# EAGLE design goodfet23 (EAGLE 5.06)
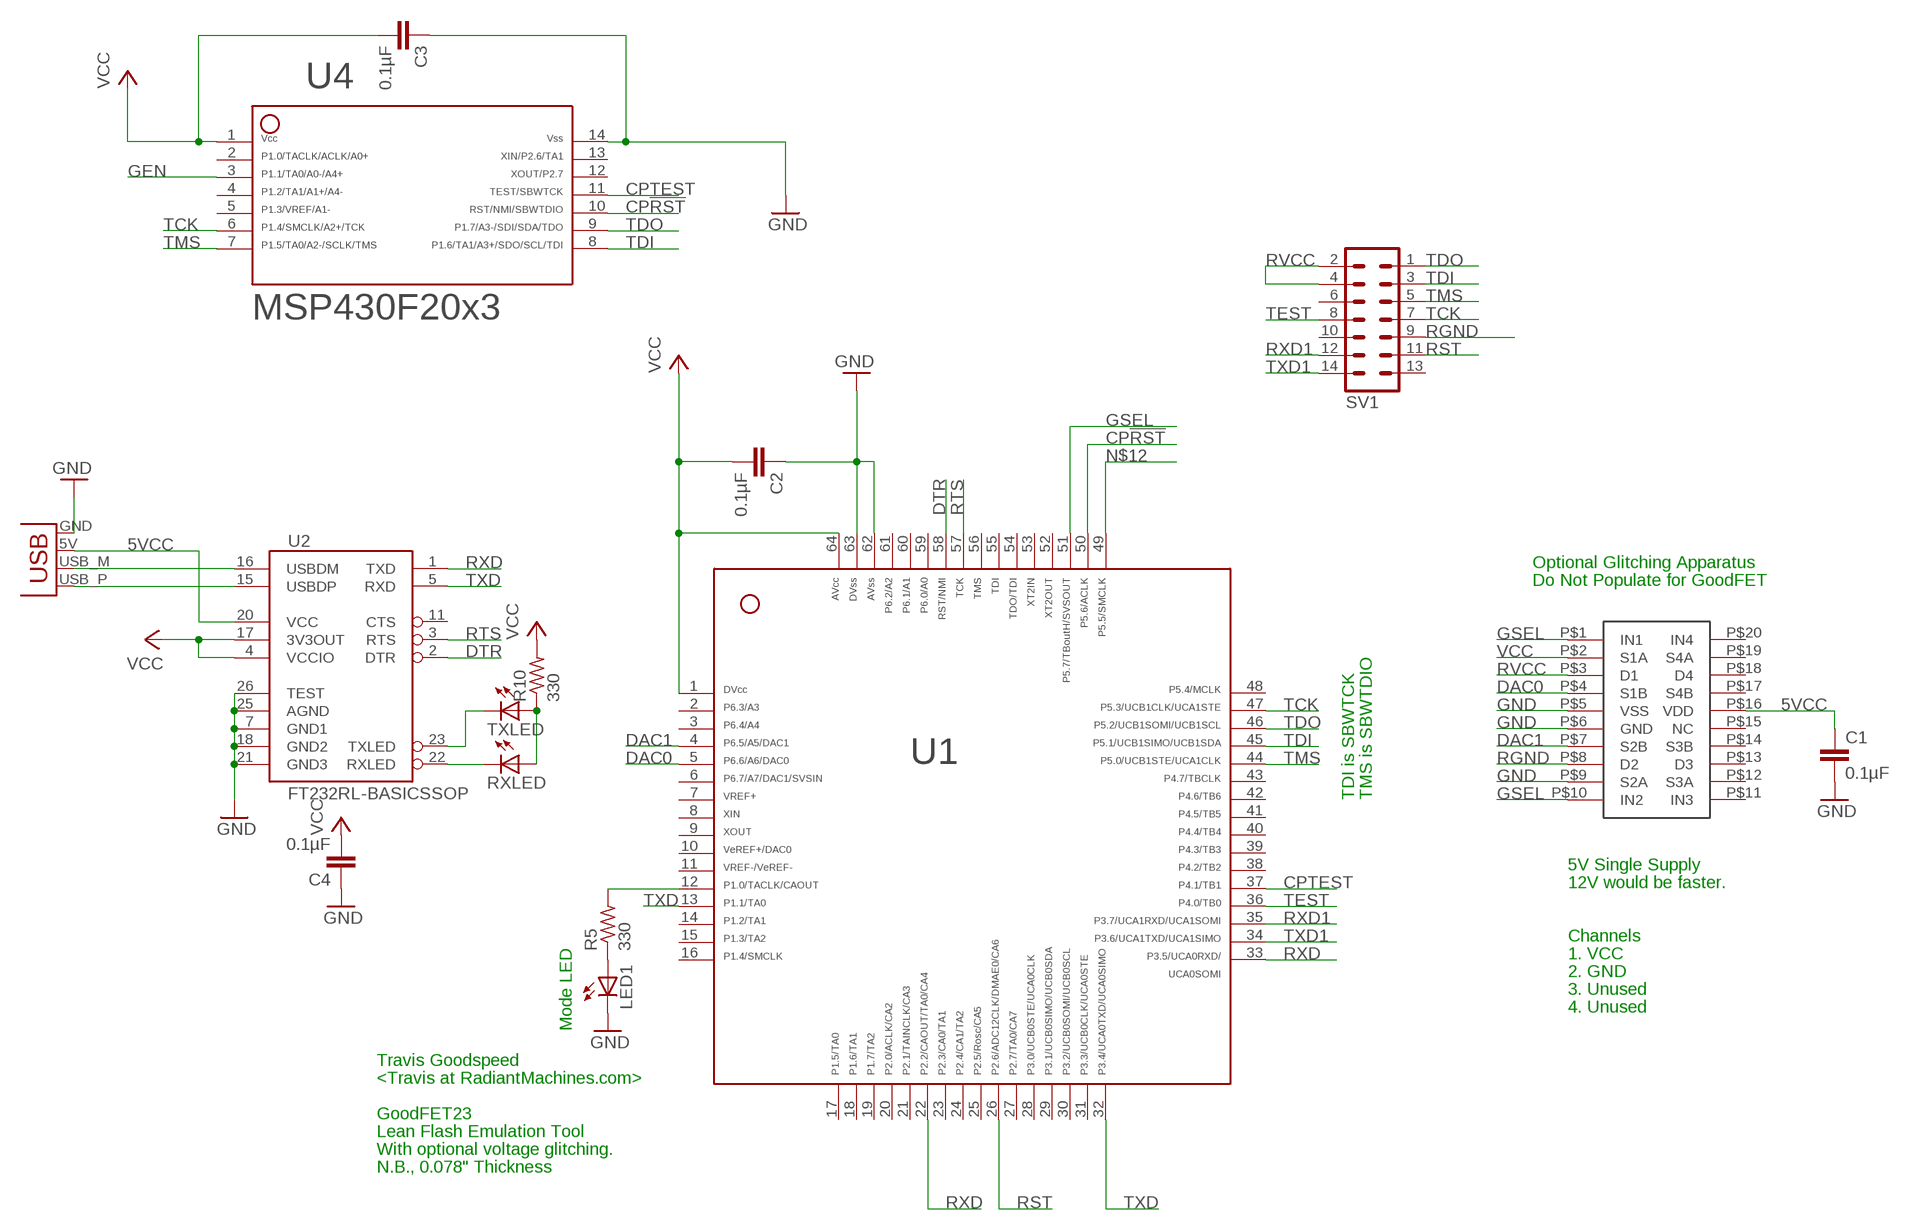
[diagram p0: schematic, sheet 1]

## Parts
C1  0.1µF  C-EUC0603  [C0603]
C2  0.1µF  C-EUC0603  [C0603]
C3  0.1µF  C-EUC0603  [C0603]
C4  0.1µF  C-EUC0603  [C0603]
LED1  LEDCHIP-LED0603  [CHIP-LED0603]
R5  330  R-US_R0603  [R0603]
R10  330  R-US_R0603  [R0603]
RXLED  LEDCHIP-LED0603  [CHIP-LED0603]
SV1  MA07-2  [MA07-2]
TXLED  LEDCHIP-LED0603  [CHIP-LED0603]
U1  F261X---PM64  [PM/PAG64]
U2  FT232RL-BASICSSOP  [SSOP28DB]
U3  ADG1634TSSOP20  [ADG1663TSSOP]
U4  F20X3---PW14  [PW14]
X1  USBPCB  [USB-A-PCB]

## Nets
5VCC: C1.1 U2.20(VCC) U3.P$16(VDD) X1.5V(VBUS)
CP!RST: U1.50 U4.10
CPTEST: U1.37 U4.11
DAC0: U1.5 U3.P$4(S1B)
DAC1: U1.4 U3.P$7(S2B)
DTR: U1.58 U2.2(DTR)
GEN: U4.3
GND: C1.2 C2.1 C3.1 C4.1 LED1.C U1.62 U1.63 U2.7(GND1) U2.18(GND2) U2.21(GND3) U2.25(AGND) U2.26(TEST) U3.P$5(VSS) U3.P$6(GND) U3.P$9(S2A) U4.14 X1.GND
GSEL: U1.51 U3.P$1(IN1) U3.P$10(IN2)
N$1: R5.2 U1.12
N$2: LED1.A R5.1
N$3: U2.15(USBDP) X1.USB_P(D+)
N$4: U2.16(USBDM) X1.USB_M(D-)
N$6: RXLED.C U2.22(RXLED)
N$7: TXLED.C U2.23(TXLED)
N$8: R10.1 RXLED.A TXLED.A
N$12: U1.49
RGND: SV1.9 U3.P$8(D2)
RST: SV1.11 U1.26
RTS: U1.57 U2.3(RTS)
RVCC: SV1.2 SV1.4 U3.P$3(D1)
RXD: U1.22 U1.33 U2.1(TXD)
RXD1: SV1.12 U1.35
TCK: SV1.7 U1.47 U4.6
TDI: SV1.3 U1.45 U4.8
TDO: SV1.1 U1.46 U4.9
TEST: SV1.8 U1.36
TMS: SV1.5 U1.44 U4.7
TXD: U1.13 U1.32 U2.5(RXD)
TXD1: SV1.14 U1.34
VCC: C2.2 C3.2 C4.2 R10.2 U1.1 U1.64 U2.4(VCCIO) U2.17(3V3OUT) U3.P$2(S1A) U4.1
Unconnected: SV1.6 SV1.10 SV1.13 U1.2 U1.3 U1.6 U1.7 U1.8 U1.9 U1.10 U1.11 U1.14 U1.15 U1.16 U1.17 U1.18 U1.19 U1.20 U1.21 U1.23 U1.24 U1.25 U1.27 U1.28 U1.29 U1.30 U1.31 U1.38 U1.39 U1.40 U1.41 U1.42 U1.43 U1.48 U1.52 U1.53 U1.54 U1.55 U1.56 U1.59 U1.60 U1.61 U2.11(CTS) U3.P$11(IN3) U3.P$12(S3A) U3.P$13(D3) U3.P$14(S3B) U3.P$15(NC) U3.P$17(S4B) U3.P$18(D4) U3.P$19(S4A) U3.P$20(IN4) U4.2 U4.4 U4.5 U4.12 U4.13

## Notes on the sheet
- Optional Glitching Apparatus
- Do Not Populate for GoodFET
- TDI is SBWTCK | TMS is SBWTDIO
- 5V Single Supply
- 12V would be faster.
- Channels
- 1. VCC
- 2. GND
- 3. Unused
- 4. Unused
- Mode LED
- Travis Goodspeed
- <Travis at RadiantMachines.com>
- GoodFET23
- Lean Flash Emulation Tool
- With optional voltage glitching.
- N.B., 0.078" Thickness

## Library data of the parts
C1-C4 = rcl:C-EU: CAPACITOR, European symbol
LED1 RXLED TXLED = led:LED: LED OSRAM: - CHIPLED LG R971, LG N971, LY N971, LG Q971, LY Q971, LO R971, LY R971 LH N974, LH R974 LS Q976, LO Q976, LY Q976 LO Q996 - Hyper CHIPLED LW Q18S LB Q993, LB Q99A, LB R99A - SideLED LS A670, LO A670, LY A670, LG A670, LP A670 LB A673, LV A673, LT A673, LW A673 LH A674 LY A675 LS A676, LA A676, LO A676, LY A676, LW A676 LS A679, LY A679, LG A679 - Hyper Micro SIDELED® LS Y876, LA Y876, LO Y876, LY Y876 LT Y87S - SmartLED LW L88C, LW L88S LB L89C, LB L89S, LG L890 LS L89K, LO L89K, LY L89K LS L896, LA L896, LO L896, LY L896 - TOPLED LS T670, LO T670, LY T670, LG T670, LP T670 LSG T670, LSP T670, LSY T670, LOP T670, LYG T670 LG T671, LOG T671, LSG T671 LB T673, LV T673, LT T673, LW T673 LH T674 LS T676, LA T676, LO T676, LY T676, LB T676, LH T676, LSB T676, LW T676 LB T67C, LV T67C, LT T67C, LS T67K, LO T67K, LY T67K, LW E67C LS E67B, LA E67B, LO E67B, LY E67B, LB E67C, LV E67C, LT E67C LW T67C LS T679, LY T679, LG T679 LS T770, LO T770, LY T770, LG T770, LP T770 LB T773, LV T773, LT T773, LW T773 LH T774 LS E675, LA E675, LY E675, LS T675 LS T776, LA T776, LO T776, LY T776, LB T776 LHGB T686 LT T68C, LB T68C - Hyper Mini TOPLED® LB M676 - Mini TOPLED Santana® LG M470 LS M47K, LO M47K, LY M47K Source: http://www.osram.convergy.de LUXEON: - LUMILED® LXK2-PW12-R00, LXK2-PW12-S00, LXK2-PW14-U00, LXK2-PW14-V00 LXK2-PM12-R00, LXK2-PM12-S00, LXK2-PM14-U00 LXK2-PE12-Q00, LXK2-PE12-R00, LXK2-PE12-S00, LXK2-PE14-T00, LXK2-PE14-U00 LXK2-PB12-K00, LXK2-PB12-L00, LXK2-PB12-M00, LXK2-PB14-N00, LXK2-PB14-P00, LXK2-PB14-Q00 LXK2-PR12-L00, LXK2-PR12-M00, LXK2-PR14-Q00, LXK2-PR14-R00 LXK2-PD12-Q00, LXK2-PD12-R00, LXK2-PD12-S00 LXK2-PH12-R00, LXK2-PH12-S00 LXK2-PL12-P00, LXK2-PL12-Q00, LXK2-PL12-R00 Source: www.luxeon.com KINGBRIGHT: KA-3528ASYC Source: www.kingbright.com
R5 R10 = rcl:R-US_: RESISTOR, American symbol
SV1 = con-lstb:MA07-2: PIN HEADER
U1 = TI_MSP430_v13:F261X---PM64: ***MSP430F261x***PM64
U2 = SparkFun:FT232RL-BASIC: USB UART This is the simplified version of the FT232RL unit. Only what you need, nothing you don't. Spark Fun Electronics SKU : COM-00650
U3 = adg1634:ADG1634: The ADG1634 is a monolithic industrial CMOS analog switch comprising four independently selectable SPDT switches. It can be powered at 3V to 12V, single or double supply. At 5V single supply, it has a 200ns swich time.
U4 = TI_MSP430_v13:F20X3---PW14: ***MSP430F20x3***PW14
X1 = SparkFun:USB: USB Connectors USB-B-PTH is fully proven SKU : PRT-00139 USB-miniB is fully proven SKU : PRT-00587 USB-A-PCB is untested. USB-A-H is throughly reviewed, but untested. Spark Fun Electronics SKU : PRT-00437 USB-B-SMT is throughly reviewed, but untested. Needs silkscreen touching up. USB-A-S has not been used/tested USB-MB-H has not been used/tested

## Board
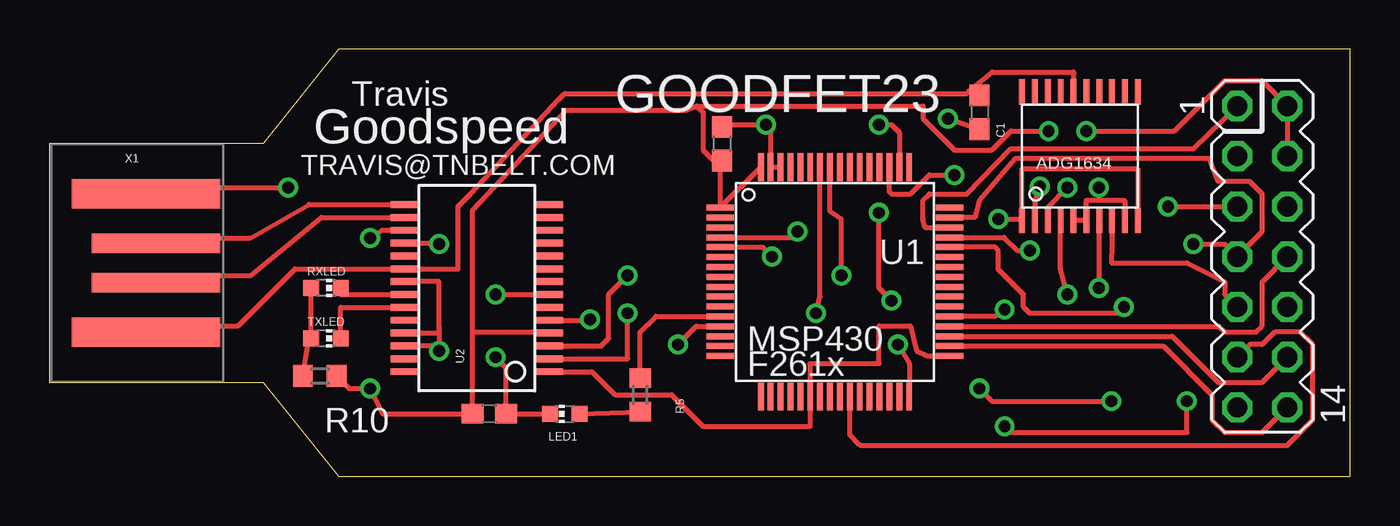
[diagram p1: board, top side]
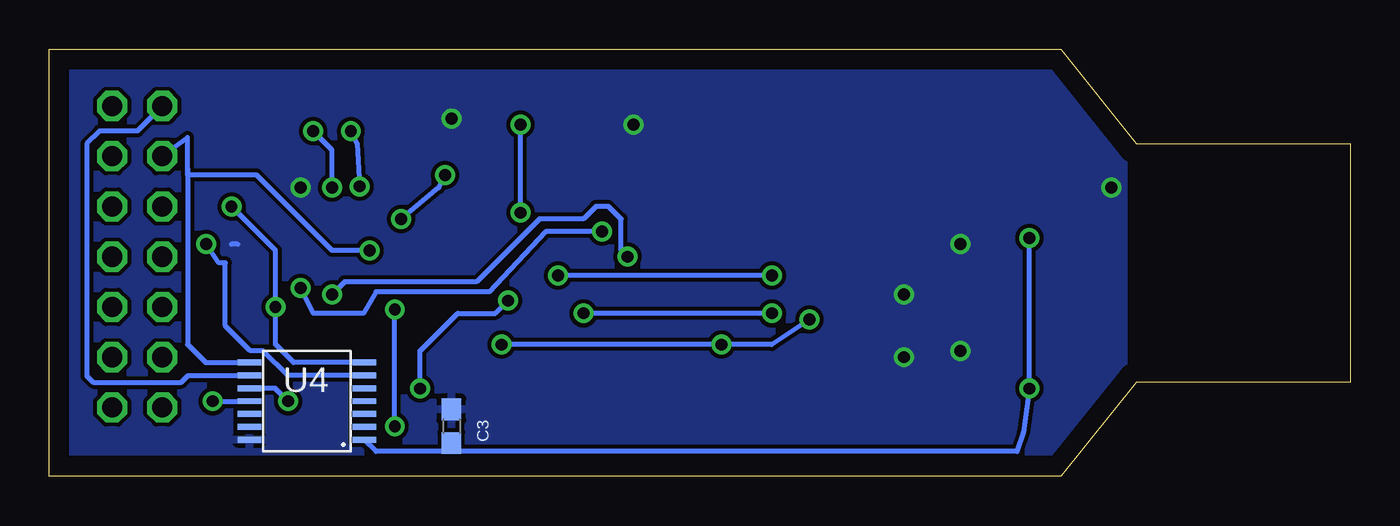
[diagram p2: board, bottom side, seen from below]

Size 65.71 x 21.59 mm. Coordinates in mm from the lower left corner, seen from the top.
Outline: 14.61,0 65.71,0 65.71,21.59 14.61,21.59 10.79,16.83 0,16.83 0,4.76 10.79,4.76 14.61,0
Copper layers (1*16): Top 0.035mm / dielectric 1.5mm / Bottom 0.035mm
Design rules "default *": minimum track width 10mil, minimum drill 10mil, track to track 8mil, track to pad 8mil, pad to pad 5mil, via to via 8mil, smd to smd 8mil, copper to edge 40mil, drill to drill 8mil, minimum pad ring 10mil, minimum via ring 8mil, stop-mask expansion 4mil, vias tented up to drill 0mil, thermal gap 10mil

### Footprints (pad centres in the part's own frame; a part is rotated, then mirrored left to right if it is on the bottom)
C0603 = smd 1.1 x 1: 1 -0.85,0; 2 0.85,0
CHIP-LED0603 = smd 0.8 x 0.8: A 0,-0.75; C 0,0.75
R0603 = smd 1 x 1.1: 1 -0.85,0; 2 0.85,0
MA07-2 = drill 1.016 octagon: 1 -7.62,-1.27; 2 -7.62,1.27; 3 -5.08,-1.27; 4 -5.08,1.27; 5 -2.54,-1.27; 6 -2.54,1.27; 7 0,-1.27; 8 0,1.27; 9 2.54,-1.27; 10 2.54,1.27; 11 5.08,-1.27; 12 5.08,1.27; 13 7.62,-1.27; 14 7.62,1.27
PM/PAG64 = smd 1.4 x 0.3: 1 -5.8,3.75; 2 -5.8,3.25; 3 -5.8,2.75; 4 -5.8,2.25; 5 -5.8,1.75; 6 -5.8,1.25; 7 -5.8,0.75; 8 -5.8,0.25; 9 -5.8,-0.25; 10 -5.8,-0.75; 11 -5.8,-1.25; 12 -5.8,-1.75; 13 -5.8,-2.25; 14 -5.8,-2.75; 15 -5.8,-3.25; 16 -5.8,-3.75; 33 5.8,-3.75; 34 5.8,-3.25; 35 5.8,-2.75; 36 5.8,-2.25; 37 5.8,-1.75; 38 5.8,-1.25; 39 5.8,-0.75; 40 5.8,-0.25; 41 5.8,0.25; 42 5.8,0.75; 43 5.8,1.25; 44 5.8,1.75; 45 5.8,2.25; 46 5.8,2.75; 47 5.8,3.25; 48 5.8,3.75 | smd 0.3 x 1.4: 17 -3.75,-5.8; 18 -3.25,-5.8; 19 -2.75,-5.8; 20 -2.25,-5.8; 21 -1.75,-5.8; 22 -1.25,-5.8; 23 -0.75,-5.8; 24 -0.25,-5.8; 25 0.25,-5.8; 26 0.75,-5.8; 27 1.25,-5.8; 28 1.75,-5.8; 29 2.25,-5.8; 30 2.75,-5.8; 31 3.25,-5.8; 32 3.75,-5.8; 49 3.75,5.8; 50 3.25,5.8; 51 2.75,5.8; 52 2.25,5.8; 53 1.75,5.8; 54 1.25,5.8; 55 0.75,5.8; 56 0.25,5.8; 57 -0.25,5.8; 58 -0.75,5.8; 59 -1.25,5.8; 60 -1.75,5.8; 61 -2.25,5.8; 62 -2.75,5.8; 63 -3.25,5.8; 64 -3.75,5.8
SSOP28DB = smd 0.348 x 1.397: 1 -4.225,-3.656; 2 -3.575,-3.656; 3 -2.925,-3.656; 4 -2.275,-3.656; 5 -1.625,-3.656; 6 -0.975,-3.656; 7 -0.325,-3.656; 8 0.325,-3.656; 9 0.975,-3.656; 10 1.625,-3.656; 11 2.275,-3.656; 12 2.925,-3.656; 13 3.575,-3.656; 14 4.225,-3.656; 15 4.225,3.656; 16 3.575,3.656; 17 2.925,3.656; 18 2.275,3.656; 19 1.625,3.656; 20 0.975,3.656; 21 0.325,3.656; 22 -0.325,3.656; 23 -0.975,3.656; 24 -1.625,3.656; 25 -2.275,3.656; 26 -2.925,3.656; 27 -3.575,3.656; 28 -4.225,3.656
ADG1663TSSOP = smd 1.27 x 0.3: P$1 -3.25,3.25; P$2 -3.25,2.6; P$3 -3.25,1.95; P$4 -3.25,1.3; P$5 -3.25,0.65; P$6 -3.25,0; P$7 -3.25,-0.65; P$8 -3.25,-1.3; P$9 -3.25,-1.95; P$10 -3.25,-2.6; P$11 3.25,-2.6; P$12 3.25,-1.95; P$13 3.25,-1.3; P$14 3.25,-0.65; P$15 3.25,0; P$16 3.25,0.65; P$17 3.25,1.3; P$18 3.25,1.95; P$19 3.25,2.6; P$20 3.25,3.25
PW14 = smd 0.3 x 1.2: 1 -1.95,-2.9; 2 -1.3,-2.9; 3 -0.65,-2.9; 4 0,-2.9; 5 0.65,-2.9; 6 1.3,-2.9; 7 1.95,-2.9; 8 1.95,2.9; 9 1.3,2.9; 10 0.65,2.9; 11 0,2.9; 12 -0.65,2.9; 13 -1.3,2.9; 14 -1.95,2.9
USB-A-PCB = smd 7.5 x 1.5: 5V -0.2,-3.5; GND -0.2,3.5 | smd 6.5 x 1: USB_M 0.3,-1; USB_P 0.3,1

### Placement (x,y rotation side)
C1  46.99,18.41 270 top
C2  33.97,16.83 270 top
C3  45.4,2.54 270 bottom
C4  22.22,3.17 180 top
LED1  26.04,3.17 90 top
R5  29.84,4.13 90 top
R10  13.65,5.08 0 top
RXLED  13.97,9.53 270 top
SV1  61.28,11.11 270 top
TXLED  13.97,6.99 270 top
U1  39.69,9.84 0 top
U2  21.59,9.53 90 top
U3  52.39,16.19 90 top
U4  52.71,3.81 90 bottom
X1  5.08,10.79 0 top

### Tracks (layer width: path | path; a pad name or v marks a point on that pad's centre or on a via)
5VCC
  Top 0.254: X1.5V 5.21,7.62 9.53,7.62 12.4,10.5 U2.20 20.61,10.5 20.64,10.48 20.64,13.65 21.27,14.29 25.72,19.05 26.04,19.37 46.36,19.37 46.51,19.53 | 46.51,19.53 47.62,20.45 51.75,20.45 51.74,20.31 U3.P$16 | C1.1 46.77,19.27 46.51,19.53
CP!RST  (via drill 0.6)
  Top 0.254: v53.66,3.81 47.62,3.81 v46.99,4.45 | v42.55,8.89 41.91,9.52 v41.91,13.34 | v41.91,17.78 42.55,17.78 | 42.55,17.78 42.86,17.46 | U1.50 42.94,17.39 42.55,17.78
  Bottom 0.254: U4.10 54.31,4.46 v53.66,3.81 | v46.99,4.45 46.99,6.35 45.09,8.26 43.18,8.26 v42.55,8.89 | v41.91,13.34 v41.91,17.78
CPTEST  (via drill 0.6)
  Top 0.254: v48.26,8.45 47.78,8.09 U1.37 | v57.47,3.81 57.47,2.22 48.26,2.22 v48.26,2.54
  Bottom 0.254: v57.47,3.81 U4.11 | v48.26,2.54 v48.26,8.45
DAC0  (via drill 0.6)
  Top 0.254: 36.2,11.11 v36.51,11.11 36.03,11.59 U1.5 | U3.P$4 51.09,10.51 v51.44,9.21
  Bottom 0.254: v36.51,11.11 36.83,11.43 36.83,13.02 37.47,13.65 38.1,13.65 38.73,13.02 40.96,13.02 44.13,9.84 50.8,9.84 v51.44,9.21
DAC1  (via drill 0.6)
  Top 0.254: 37.47,12.38 v37.78,12.38 37.49,12.09 U1.4 | U3.P$7 53.04,9.54 v53.02,9.52
  Bottom 0.254: v37.78,12.38 40.64,12.38 43.5,9.33 49.21,9.33 49.85,8.26 52.39,8.26 v53.02,9.52
DTR  (via drill 0.6)
  Top 0.254: U2.2 29.21,5.95 v29.21,8.26 | U1.58 38.94,9.09 v38.73,8.26
  Bottom 0.254: v29.21,8.26 v38.73,8.26
GND  (via drill 0.6)
  Top 0.254: X1.GND 5.21,14.6 v12.06,14.6 | U2.18 19.68,11.8 v19.68,11.75 | 19.68,7.62 19.68,6.6 | 19.68,6.6 U2.26 | 19.68,6.6 v19.68,6.35 | U2.25 19.68,7.25 19.68,7.62 | U2.21 19.68,9.85 19.68,7.62 | LED1.C C4.1 23.07,5.5 v22.54,6.03 | U3.P$5 U3.P$6 52.39,13.97 | 52.39,13.97 54.29,13.97 54.34,13.92 U3.P$9 | C1.2 46.89,17.56 v45.4,18.1 | C2.1 34.08,17.78 v36.2,17.78 36.44,17.54 U1.63 U1.62 | U2.7 v22.54,9.21 | 52.39,13.97 53.02,13.97 v53.02,14.6
  Bottom 0.254: 56.2,11.75 56.52,11.75 | v22.54,9.21 22.86,9.21
  pour Bottom: 11.75,20.95 64.77,20.95 65.09,1.27 11.43,1.27 11.43,20.64
GSEL  (via drill 0.6)
  Top 0.254: v47.94,13.02 49.06,13.02 U3.P$1 49.14,15.56 54.99,15.56 U3.P$10 | U1.51 42.44,14.4 42.55,14.29 43.5,14.29 44.45,15.24 v45.72,15.24
  Bottom 0.254: v45.72,15.24 46.04,14.6 v47.94,13.02
N$1
  Top 0.254: U1.12 30.63,8.09 29.84,7.3 R5.2
N$2
  Top 0.254: LED1.A R5.1
N$3
  Top 0.254: U2.15 13.12,13.75 10.16,12.07 5.65,12.07 X1.USB_P
N$4
  Top 0.254: U2.16 13.73,13.1 10.16,10.16 5.75,10.16 X1.USB_M
N$6
  Top 0.254: U2.22 14.72,9.2 RXLED.C
N$7
  Top 0.254: U2.23 14.72,8.55 TXLED.C
N$8
  Top 0.254: RXLED.A TXLED.A 13.12,6.99 R10.1
RGND
  Top 0.254: U3.P$8 53.69,11.72 53.66,10.79 57.47,10.79 59.37,9.84 59.37,9.21 SV1.9
RST
  Top 0.254: U1.26 40.44,2.11 40.96,1.59 62.55,1.59 63.82,2.86 63.82,6.67 63.18,7.3 61.91,7.3 61.28,6.67 60.64,6.67 SV1.11
RTS  (via drill 0.6)
  Top 0.254: U2.3 27.87,6.6 28.26,6.99 28.26,9.21 v29.21,10.16 | v40.01,10.16 40.01,13.02 39.44,13.4 U1.57
  Bottom 0.254: v29.21,10.16 v40.01,10.16
RVCC  (via drill 0.6)
  Top 0.254: SV1.4 SV1.2 61.28,20 59.37,20 56.83,17.46 v52.39,17.46 | U3.P$3 50.44,13.61 v51.44,14.6
  Bottom 0.254: v51.44,14.6 51.44,16.51 v52.39,17.46
RXD
  Top 0.254: U2.1 27.4,5.3 28.57,4.13 31.43,4.13 33.02,2.54 38.42,2.54 38.44,2.56 U1.22 38.44,5.7 38.42,5.71 41.91,5.71 41.91,7.62 43.5,7.62 43.82,6.35 44.39,6.09 U1.33
RXD1
  Top 0.254: U1.35 56.73,7.09 59.05,4.76 61.28,4.76 SV1.12
TCK  (via drill 0.6)
  Top 0.254: U1.47 46.75,13.09 46.99,13.97 48.77,16.07 58.61,16.07 59.05,14.92 60.64,14.92 61.28,14.29 61.28,12.38 SV1.7 59.37,11.75 v57.79,11.75
  Bottom 0.254: U4.6 53.69,5.11 54.93,6.35 55.56,6.35 56.83,7.62 56.83,10.79 57.15,10.79 v57.79,11.75
TDI  (via drill 0.6)
  Top 0.254: U1.45 48.23,12.09 48.9,11.43 v49.53,11.43
  Bottom 0.254: SV1.3 58.74,17.15 58.74,15.56 | U4.8 57.83,5.76 58.74,6.67 58.74,15.56 | v49.53,11.43 51.44,11.43 55.25,15.24 58.74,15.24 58.74,15.56
TDO
  Top 0.254: U1.46 44.24,12.59 44.13,13.02 44.13,13.97 44.45,14.29 46.36,14.29 48.58,16.57 57.79,16.57 SV1.1
  Bottom 0.254: U4.9 58.71,5.11 59.05,4.76 63.5,4.76 63.82,5.08 63.82,16.83 63.18,17.46 61.28,17.46 SV1.1
TEST
  Top 0.254: SV1.8 61.28,9.84 61.28,7.62 60.96,7.3 59.37,7.3 59.08,7.59 U1.36
TMS  (via drill 0.6)
  Top 0.254: U1.44 47.78,11.59 47.94,11.43 47.94,10.48 49.21,9.21 49.21,8.57 49.53,8.26 53.98,8.26 v54.29,8.57 | v56.52,13.65 SV1.5
  Bottom 0.254: U4.7 53.39,5.76 54.29,6.67 v54.29,8.57 54.29,11.43 v56.52,13.65
TXD  (via drill 0.6)
  Top 0.254: U1.13 32.68,7.59 v31.75,6.67 | U2.5 26.95,7.9 v27.3,7.94 | U1.32 43.44,5.71 v42.86,6.67
  Bottom 0.254: v27.3,7.94 29.21,6.67 v31.75,6.67 v42.86,6.67
TXD1
  Top 0.254: U1.34 56.27,6.59 58.74,4.13 58.74,2.86 59.37,2.22 61.28,2.22 SV1.14
VCC  (via drill 0.6)
  Top 0.254: U2.17 16.83,12.45 v16.19,12.07 | R10.2 15.14,4.45 v16.19,4.45 16.83,3.17 C4.2 21.38,7.3 | U1.64 U1.1 33.89,15.89 C2.2 33.55,15.98 33.02,16.51 33.02,18.42 32.7,18.73 | 21.38,7.3 21.38,13.44 26.14,18.52 32.17,18.52 32.7,18.73 | U2.4 25.19,7.3 21.38,7.3 | 32.7,18.73 44.13,18.73 44.13,18.1 45.72,16.51 47.62,16.51 48.58,17.46 v50.48,17.46 | U3.P$2 49.79,13.91 v50.04,14.67
  Bottom 0.254: v16.19,12.07 v16.19,4.45 16.51,2.22 16.83,1.27 45.4,1.27 | v50.04,14.67 50.16,16.83 v50.48,17.46 | U4.1 49.22,1.27 45.4,1.27 | 45.4,1.27 C3.2

### Text on the board
tPlace: Travis | GOODFET23 | Goodspeed | TRAVIS@TNBELT.COM
tNames: ADG1634 | MSP430 | F261x